# EAGLE board BAIT MicroMod Carrier Board (EAGLE 9.6.2)
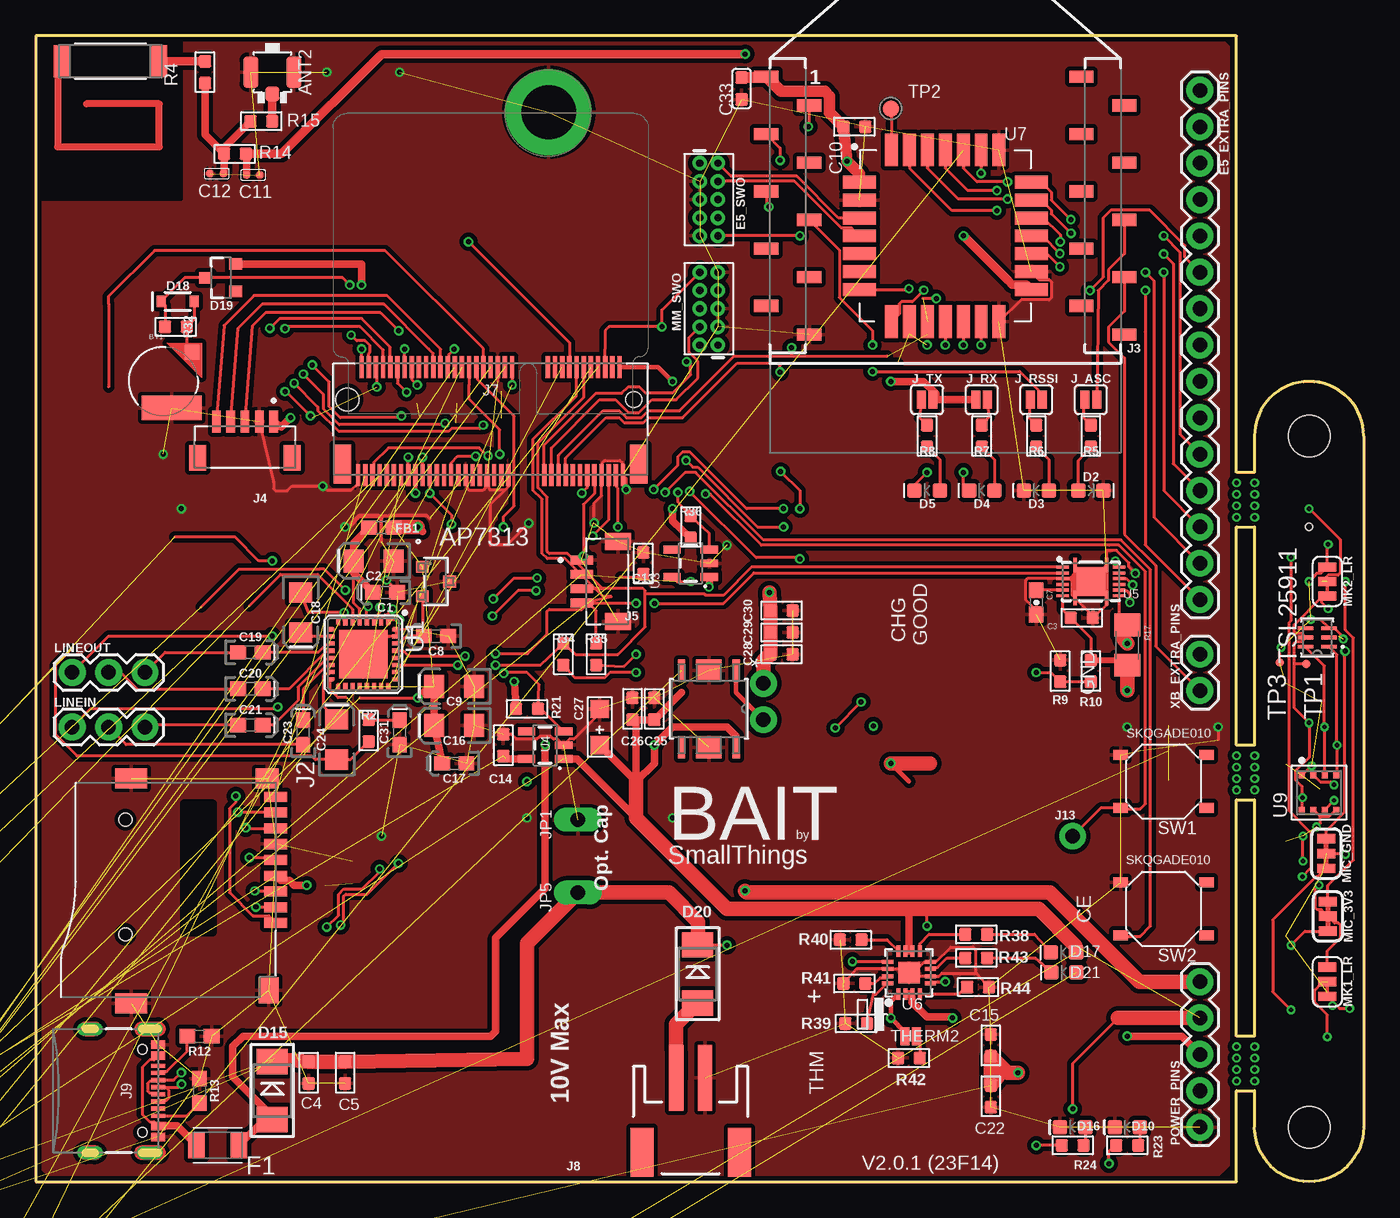
[diagram p2: board, top side]
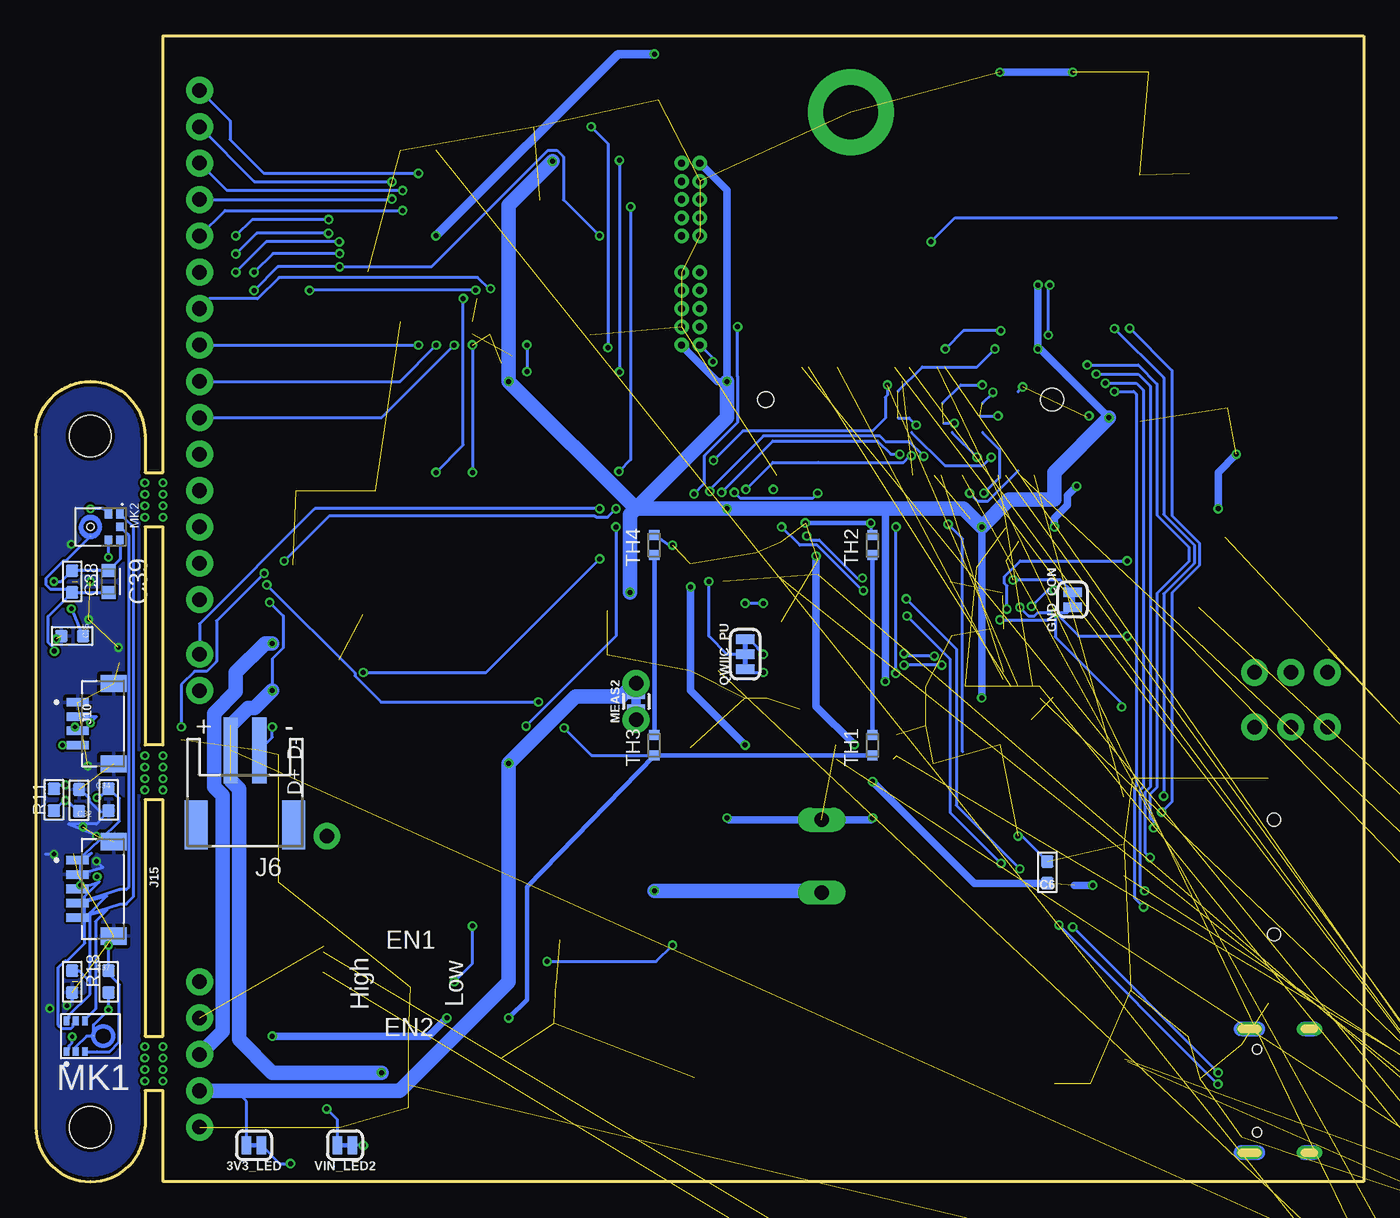
[diagram p3: board, bottom side, seen from below]

Size 92.71 x 80.01 mm. Coordinates in mm from the lower left corner, seen from the top.
Outline: 92.71,52.07 arc90 88.9,55.88
Outline: 92.71,52.07 92.71,3.81 arc-180 85.09,3.81 85.09,6.35 83.82,6.35 83.82,0 0,0 0,80.01 83.82,80.01 83.82,49.53 85.09,49.53 85.09,52.07 arc-180 92.71,52.07
Outline: 83.82,30.48 85.09,30.48 85.09,45.72 83.82,45.72 83.82,30.48
Outline: 83.82,26.67 85.09,26.67 85.09,10.16 83.82,10.16 83.82,26.67
Copper layers (1*16): Top 0.035mm / dielectric 1.5mm / Bottom 0.035mm
Design rules "seeed-studio-2-layer": minimum track width 6mil, minimum drill 12mil, track to track 6mil, track to pad 6mil, pad to pad 6mil, via to via 6mil, smd to smd 0mil, copper to edge 10mil, drill to drill 10mil, minimum pad ring 10mil, minimum via ring 6mil, stop-mask expansion 2mil, vias tented up to drill 100mil, thermal gap 10mil
Net classes: 0 default: width 0 mm, drill 0 mm
Holes 2.9 mm at 88.9,3.81 88.9,52.07
tKeepout: area 0,69 to 10,80
bKeepout: area 0,69 to 10,72

## Footprints (pad centres in the part's own frame; a part is rotated, then mirrored left to right if it is on the bottom)
SMT-JUMPER_2_NC_TRACE_SILK = smd 0.66 x 1.27: 1 -0.521,0; 2 0.521,0
SMT-JUMPER_3_1-NC_TRACE_SILK = smd 0.635 x 1.27: 1 -1.016,0; 2 0,0; 3 1.016,0
ANT_0868AT43A0020E_JOT = smd 1.168 x 2.21: 1 -3.378,0; 2 3.378,0
U-FL3P-SMD-2.6X2.6X1.0MM = smd 1.05 x 1: D -1.524,0 | smd 2.2 x 1.05: GND1 0,1.5; GND2 0,-1.5
SMT-JUMPER_2_NO_NO-SILK = smd 0.635 x 1.27: 1 -0.406,0; 2 0.406,0
ML414H_IV01E = smd 1 x 1: + 2.022,2.032 | smd 4.2 x 1.7: - 0.6,-1.85
0603-POLAR = smd 1.1 x 1: + 0.85,0; - -0.85,0
EIA3216 = smd 1.4 x 1.6: + 1.4,0; - -1.4,0
C0603 = smd 0.889 x 0.889: 1 0,0.762; 2 0,-0.762
0603-CAP = smd 1.1 x 1: 1 -0.85,0; 2 0.85,0
C0402 = smd 0.5 x 0.5: 1 -0.463,0; 2 0.463,0
AVX-A = smd 1.27 x 1.27: + -1.27,0; - 1.27,0
C0603' = smd 0.889 x 0.889: 1 -0.762,0; 2 0.762,0
CAPC1608X85 = smd 0.921 x 0.97: 1 -0.775,0; 2 0.775,0
LED-0603 = smd 1 x 1: A -0.877,0; C 0.877,0
SMADIODE = smd 1.778 x 2.159: A 2.019,0; C -2.045,0
SOD-323 = smd 0.63 x 0.83: A 1.15,0; C -1.15,0
SOT23-3 = smd 0.8 x 0.9: 1 -0.95,-1; 2 0.95,-1; 3 0,1.1
1X15 = drill 1.016 pad 1.88: 1 0,0; 2 2.54,0; 3 5.08,0; 4 7.62,0; 5 10.16,0; 6 12.7,0; 7 15.24,0; 8 17.78,0; 9 20.32,0; 10 22.86,0; 11 25.4,0; 12 27.94,0; 13 30.48,0; 14 33.02,0; 15 35.56,0
2X5-PTH-1.27MM = drill 0.508 pad 1: 1 -2.54,-0.635; 2 -2.54,0.635; 3 -1.27,-0.635; 4 -1.27,0.635; 5 0,-0.635; 6 0,0.635; 7 1.27,-0.635; 8 1.27,0.635; 9 2.54,-0.635; 10 2.54,0.635
FUSC3215X82N = smd 1.165 x 1.814: 1 -1.475,0; 2 1.475,0
0603 = smd 1.1 x 1: 1 -0.85,0; 2 0.85,0
STAND-OFF-REFLOW-M2.5 = drill 3.8 pad 6: 1 0,0
SUNTECH_ST-TF-003A = smd 0.7 x 1.6: 1 3.52,5.33; 2 2.42,5.33; 3 1.32,5.33; 4 0.22,5.33; 5 -0.88,5.33; 6 -1.98,5.33; 7 -3.08,5.33; 8 -4.18,5.33; 9 -5.28,5.33 | smd 1.4 x 1.6: G1 -6.58,4.73 | smd 1.4 x 2.2: G2 -6.58,-4.77; G3 9.12,-4.77 | smd 1.8 x 1.4: G4 8.22,4.83 | hole 0.9: -3.68,-5.17; 4.32,-5.17
XBEE-SMD = smd 1.7 x 0.85: 1 -12.5,20; 2 -9.5,18; 3 -12.5,16; 4 -9.5,14; 5 -12.5,12; 6 -9.5,10; 7 -12.5,8; 8 -9.5,6; 9 -12.5,4; 10 -9.5,2; 11 12.5,2; 12 9.5,4; 13 12.5,6; 14 9.5,8; 15 12.5,10; 16 9.5,12; 17 12.5,14; 18 9.5,16; 19 12.5,18; 20 9.5,20
JST_BM05B-SRSS-TB(LF)(SN) = smd 0.6 x 1.55: 1 -2,-2.525; 2 -1,-2.525; 3 0,-2.525; 4 1,-2.525; 5 2,-2.525 | smd 1.2 x 1.8: S1 -3.3,0; S2 3.3,0
JST_BM04B-SRSS-TB(LF)(SN) = smd 0.6 x 1.55: 1 -1.5,-2.525; 2 -0.5,-2.525; 3 0.5,-2.525; 4 1.5,-2.525 | smd 1.2 x 1.8: S1 -2.8,0; S2 2.8,0
JST-PH-2-SMT-RA = smd 1 x 4.6: 1 1,-3.7; 2 -1,-3.7 | smd 1.6 x 3.4: NC1 -3.4,1.5; NC2 3.4,1.5
M.2-CONNECTOR-E = smd 0.3 x 1.55: 1 9.25,-5.275; 2 9,2.275; 3 8.75,-5.275; 4 8.5,2.275; 5 8.25,-5.275; 6 8,2.275; 7 7.75,-5.275; 8 7.5,2.275; 9 7.25,-5.275; 10 7,2.275; 11 6.75,-5.275; 12 6.5,2.275; 13 6.25,-5.275; 14 6,2.275; 15 5.75,-5.275; 16 5.5,2.275; 17 5.25,-5.275; 18 5,2.275; 19 4.75,-5.275; 20 4.5,2.275; 21 4.25,-5.275; 22 4,2.275; 23 3.75,-5.275; 32 1.5,2.275; 33 1.25,-5.275; 34 1,2.275; 35 0.75,-5.275; 36 0.5,2.275; 37 0.25,-5.275; 38 0,2.275; 39 -0.25,-5.275; 40 -0.5,2.275; 41 -0.75,-5.275; 42 -1,2.275; 43 -1.25,-5.275; 44 -1.5,2.275; 45 -1.75,-5.275; 46 -2,2.275; 47 -2.25,-5.275; 48 -2.5,2.275; 49 -2.75,-5.275; 50 -3,2.275; 51 -3.25,-5.275; 52 -3.5,2.275; 53 -3.75,-5.275; 54 -4,2.275; 55 -4.25,-5.275; 56 -4.5,2.275; 57 -4.75,-5.275; 58 -5,2.275; 59 -5.25,-5.275; 60 -5.5,2.275; 61 -5.75,-5.275; 62 -6,2.275; 63 -6.25,-5.275; 64 -6.5,2.275; 65 -6.75,-5.275; 66 -7,2.275; 67 -7.25,-5.275; 68 -7.5,2.275; 69 -7.75,-5.275; 70 -8,2.275; 71 -8.25,-5.275; 72 -8.5,2.275; 73 -8.75,-5.275; 74 -9,2.275; 75 -9.25,-5.275 | smd 1.2 x 2.75: A1 10.35,-4.5; A2 -10.35,-4.5 | hole 1.1: 10,0 | hole 1.6: -10,0
JST-2-SMD = smd 1 x 4.6: 1 -1,-3.7; 2 1,-3.7 | smd 1.6 x 3.4: NC1 -3.4,1.5; NC2 3.4,1.5
USB-C-16P-2LAYER-PADS = smd 0.3 x 1: A5 -1.25,-0.34; A6 -0.25,-0.34; A7 0.25,-0.34; A8 1.25,-0.34; B5 1.75,-0.34; B6 0.75,-0.34; B7 -0.75,-0.34; B8 -1.75,-0.34 | smd 0.6 x 1: GND -3.225,-0.34; GND2 3.225,-0.34; VBUS1 -2.45,-0.34; VBUS2 2.45,-0.34 | drill 0.4 pad 0.6 long: SHLD1 -4.318,-0.915; SHLD2 4.318,-0.915; SHLD3 -4.318,-5.095; SHLD4 4.318,-5.095 | hole 0.65: -2.89,-1.445; 2.89,-1.445
CONN8_MS02QE_CNK = drill 1.651 pad 2.159: 1 0,0; 2 0,-4.6; 3 0,-9.2; 4 0,-13.8; 5 5.72,-13.8; 6 5.72,-9.2; 7 5.72,-4.6; 8 5.72,0
1X01_NO_SILK = drill 1.016 pad 1.88: 1 0,0
CUI_SJ-3551B-MSMT-TR-67 = drill 0.4 pad 0.8 long: 1 4.7,-1.54; 2 4.7,-9.42; 3 4.7,-4.63; 4 -4.7,-1.62; 5 -4.7,-5.57; 6 -4.7,-8.37
SMT-JUMPER_2_NO_SILK = smd 0.635 x 1.27: 1 -0.406,0; 2 0.406,0
1X01_OVAL = drill 1 pad 1.676 long: 1 0,0
SMT-JUMPER_2_NC_TRACE_NO-SILK = smd 0.66 x 1.27: 1 -0.521,0; 2 0.521,0
1X03 = drill 1.016 pad 1.88: 1 0,0; 2 2.54,0; 3 5.08,0
COMBO-JUMPER_2_NC_TRACE = smd 0.635 x 1.27: 1 -0.508,0; 2 0.508,0 | drill 1.016 pad 1.88: 3 -1.27,0; 4 1.27,0
SMT-JUMPER_3_2-NC_TRACE_SILK = smd 0.66 x 1.27: 1 -1.041,0; 2 0,0; 3 1.041,0
ICS-43432 = smd 0.6 x 0.4: 1 -1.075,1.675; 2 -1.075,1.025; 3 -1.075,0.375; 5 1.075,0.375; 6 1.075,1.025; 7 1.075,1.675 | smd 0.1 x 0.1: 4 0.025,-0.225
MIC_SPH0645LM4H-B = smd 0.6 x 0.522: 1 -0.9,2.074; 2 -0.9,1.252; 4 0.9,1.252; 5 0.9,2.074; 6 0,2.074 | smd 0.1 x 0.1: 3 0.65,0.02 | hole 0.5: 0,0
1X05 = drill 1.016 pad 1.88: 1 0,0; 2 2.54,0; 3 5.08,0; 4 7.62,0; 5 10.16,0
R0603 = smd 0.889 x 0.889: 1 0,0.762; 2 0,-0.762
1206 = smd 1.6 x 1.8: 1 -1.4,0; 2 1.4,0
AXIAL-0.3 = drill 0.9 pad 1.88: P$1 -3.81,0; P$2 3.81,0
SW4-SMD-5.2X5.2X1.5MM = smd 1 x 0.7: 1 -3,1.85; 2 3,1.85; 3 -3,-1.85; 4 3,-1.85
THERM_NTCG163JX103DT1S = smd 0.7 x 0.7: 1 -0.7,0; 2 0.7,0
TP06R = smd 0.6 x 0.6: TP 0,0
TP-D45MIL = smd 1.143 x 1.143: T 0,0
QFN-32-5MM = smd 0.4 x 0.29: 1 -2.3,1.75; 8 -2.3,-1.75; 17 2.3,-1.75; 24 2.3,1.75 | smd 0.5 x 0.29: 2 -2.25,1.25; 3 -2.25,0.75; 4 -2.25,0.25; 5 -2.25,-0.25; 6 -2.25,-0.75; 7 -2.25,-1.25; 18 2.25,-1.25; 19 2.25,-0.75; 20 2.25,-0.25; 21 2.25,0.25; 22 2.25,0.75; 23 2.25,1.25 | smd 0.29 x 0.4: 9 -1.75,-2.3; 16 1.75,-2.3; 25 1.75,2.3; 32 -1.75,2.3 | smd 0.29 x 0.5: 10 -1.25,-2.25; 11 -0.75,-2.25; 12 -0.25,-2.25; 13 0.25,-2.25; 14 0.75,-2.25; 15 1.25,-2.25; 26 1.25,2.25; 27 0.75,2.25; 28 0.25,2.25; 29 -0.25,2.25; 30 -0.75,2.25; 31 -1.25,2.25 | smd 3.4 x 3.4: PAD 0,0
SOT-23_DIO = smd 0.813 x 0.889: 1 -1.025,-0.945; 2 1.025,-0.945; 3 0,0.945
SOT23-5 = smd 0.55 x 1.2: 1 -0.95,-1.3; 2 0,-1.3; 3 0.95,-1.3; 4 0.95,1.3; 5 -0.95,1.3
PDSO-N12 = smd 0.2 x 0.85: 1 -1,-1.975; 2 -0.6,-1.975; 3 -0.2,-1.975; 4 0.2,-1.975; 5 0.6,-1.975; 6 1,-1.975; 7 1,1.975; 8 0.6,1.975; 9 0.2,1.975; 10 -0.2,1.975; 11 -0.6,1.975; 12 -1,1.975 | smd 1.95 x 1.95: EP 0,0 | smd 1 x 0.25: EP1 -1.15,1.1; EP2 -1.15,-1.1; EP3 1.15,-1.1; EP4 1.15,1.1
QFN16_3MM = smd 0.8 x 0.28: 1 -1.5,0.75; 2 -1.5,0.25; 3 -1.5,-0.25; 4 -1.5,-0.75; 9 1.5,-0.75; 10 1.5,-0.25; 11 1.5,0.25; 12 1.5,0.75 | smd 0.28 x 0.8: 5 -0.75,-1.5; 6 -0.25,-1.5; 7 0.25,-1.5; 8 0.75,-1.5; 13 0.75,1.5; 14 0.25,1.5; 15 -0.25,1.5; 16 -0.75,1.5 | smd 1.5 x 1.5: THERMAL 0,0
MOUDLE28P-1.25-12X12X2.5MM = smd 2.3 x 0.9: 1 -6,3.75; 2 -6,2.5; 3 -6,1.25; 4 -6,0; 5 -6,-1.25; 6 -6,-2.5; 7 -6,-3.75; 15 6,-3.75; 16 6,-2.5; 17 6,-1.25; 18 6,0; 19 6,1.25; 20 6,2.5; 21 6,3.75 | smd 0.9 x 2.3: 8 -3.75,-6; 9 -2.5,-6; 10 -1.25,-6; 11 0,-6; 12 1.25,-6; 13 2.5,-6; 14 3.75,-6; 22 3.75,6; 23 2.5,6; 24 1.25,6; 25 0,6; 26 -1.25,6; 27 -2.5,6; 28 -3.75,6
HSOP-6_FH006-A-P-SD-2.1_ABL = smd 1.513 x 0.517: 1 -2.692,1.91; 3 -2.692,-1.91; 4 2.692,-1.91; 6 2.692,1.91 | smd 1.513 x 1.787: 2 -2.692,0; 5 2.692,0
BOSCH_TOOLS_BME680_0 = smd 0.4 x 0.4: 1 1.2,1.2; 2 1.2,0.4; 3 1.2,-0.4; 4 1.2,-1.2; 5 -1.2,-1.2; 6 -1.2,-0.4; 7 -1.2,0.4; 8 -1.2,1.2
SON-06-FN_2000X2400_AMS = smd 1.067 x 0.254: 1 -0.826,0.65; 2 -0.826,0; 3 -0.826,-0.65; 4 0.826,-0.65; 5 0.826,0; 6 0.826,0.65
MSOP-12_MS_LIT = smd 1.328 x 0.431: 1 -2.213,1.626; 2 -2.213,0.975; 3 -2.213,0.325; 4 -2.213,-0.325; 5 -2.213,-0.975; 6 -2.213,-1.626; 7 2.213,-1.626; 8 2.213,-0.975; 9 2.213,-0.325; 10 2.213,0.325; 11 2.213,0.975; 12 2.213,1.626
1X02 = drill 1.016 pad 1.88: 1 0,0; 2 2.54,0

## Placement (x,y rotation side)
3V3_LED  [SMT-JUMPER_2_NC_TRACE_SILK]  77.47,2.54 180 bottom
3V_CODEC_JP  MK2_LR  [SMT-JUMPER_3_1-NC_TRACE_SILK]  -13.68,-8.62 0 top  (outside the outline)
3V_QWIIC2_JP  MK2_LR  [SMT-JUMPER_3_1-NC_TRACE_SILK]  -13.68,-36.96 0 top  (outside the outline)
3V_QWIIC_JP  MK2_LR  [SMT-JUMPER_3_1-NC_TRACE_SILK]  -9.99,1.75 0 top  (outside the outline)
3V_SD_JP  MK2_LR  [SMT-JUMPER_3_1-NC_TRACE_SILK]  -14.58,1.75 0 top  (outside the outline)
ANT1  0868AT43A0020EANT_0868AT43A0020E_JOT  [ANT_0868AT43A0020E_JOT]  5.21,78.23 180 top
ANT2  U-FL Connector  [U-FL3P-SMD-2.6X2.6X1.0MM]  16.51,77.47 90 top
AT_MODE  MK2_LR  [SMT-JUMPER_3_1-NC_TRACE_SILK]  -25.88,-40.83 0 top  (outside the outline)
BATT_PWR  [SMT-JUMPER_2_NO_NO-SILK]  -62.49,-40.83 0 top  (outside the outline)
BT1  ML414H  [ML414H_IV01E]  8.89,55.88 0 top
C1  2.2uF  [0603-POLAR]  24.38,41.15 180 top
C2  0.1uF  [EIA3216]  23.58,43.35 180 top
C3  1uf  [C0603]  73.03,39.37 90 top
C4  4.7uf  [C0603]  19.05,7.62 0 top
C5  4.7uf  [C0603]  21.59,7.62 0 top
C6  100nf  [C0603]  22.09,21.6 180 bottom
C7  0.47uF  [0603-CAP]  69.85,40.45 270 top
C8  2.2uF  [0603-POLAR]  27.94,38.1 180 top
C9  0.1uF  [EIA3216]  29.21,34.59 180 top
C10  4.7uf  [C0603]  57.15,73.66 270 top
C11  DNP  [C0402]  15.17,70.29 180 top
C12  DNP  [C0402]  12.63,70.39 0 top
C13  1uf  [C0603]  42.42,43.18 180 top
C14  1uf  [C0603]  32.64,30.48 180 top
C15  4.7uf  [C0603]  66.67,9.53 180 top
C16  0.1uF  [EIA3216]  29.21,31.85 180 top
C17  2.2uF  [0603-POLAR]  29.21,29.21 180 top
C18  0.15uF  [EIA3216]  18.5,39.74 270 top
C19  2.2uF  [0603-POLAR]  14.99,36.96 0 top
C20  2.2uF  [0603-POLAR]  14.99,34.42 0 top
C21  2.2uF  [0603-POLAR]  14.99,31.88 0 top
C22  4.7uf  [C0603]  66.67,5.97 0 top
C23  2.2uF  [0603-POLAR]  18.67,31.37 90 top
C24  0.1uF  [EIA3216]  21.01,30.87 90 top
C25  220nf  [C0603]  43.18,33.02 180 top
C26  100nf  [C0603]  41.66,33.02 180 top
C27  10uf  [AVX-A]  39.37,31.75 90 top
C28  1uf  [C0603]  52.07,36.83 90 top
C29  100nf  [C0603]  52.07,38.35 90 top
C30  220nf  [C0603]  52.07,39.88 90 top
C31  2.2uF  [0603-POLAR]  25.4,31.37 90 top
C32  100nf  [C0603]  89.69,26.63 180 bottom
C33  4.7uF  [C0603']  49.28,76.33 90 top
C34  100nf  [C0603]  87.63,26.67 0 bottom
C35  100nf  [C0603]  90.17,38.1 270 bottom
C36  1uf  [C0603]  -10.39,-12.35 0 top  (outside the outline)
C37  100nf  [C0603]  87.63,13.97 0 bottom
C38  100nf  [C0603]  90.17,41.91 0 bottom
C39  220pF  [CAPC1608X85]  87.63,41.91 270 bottom
C40  1uf  [C0603]  -10.39,-40.69 0 top  (outside the outline)
C41  100nf  [C0603]  -75.41,-83.47 0 top  (outside the outline)
CHG_JMP  [SMT-JUMPER_2_NO_NO-SILK]  -22.08,-40.83 0 top  (outside the outline)
D2  GREEN  [LED-0603]  73.66,48.26 0 top
D3  GREEN  [LED-0603]  69.85,48.26 180 top
D4  GREEN  [LED-0603]  66.04,48.26 180 top
D5  RED  [LED-0603]  62.23,48.26 180 top
D10  RED  [LED-0603]  76.2,3.81 180 top
D15  SK34A  [SMADIODE]  16.51,6.35 270 top
D16  Yellow  [LED-0603]  72.39,3.81 180 top
D17  RED  [LED-0603]  71.75,16 180 top
D18  3A/10V/280mV  [SOD-323]  9.91,61.47 0 top
D19  BAS70-05  [SOT23-3]  12.95,63.12 90 top
D20  SK34A  [SMADIODE]  46.21,14.49 270 top
D21  GREEN  [LED-0603]  71.78,14.61 180 top
E5_EXTRA_PINS  [1X15]  81.28,76.2 270 top
E5_SWO  JTAG  [2X5-PTH-1.27MM]  46.99,68.58 270 top
F1  6V/2A  [FUSC3215X82N]  12.7,2.54 0 top
FB1  600Ω/1.8A  [0603]  24.11,45.68 180 top
GND_CON  [SMT-JUMPER_2_NC_TRACE_SILK]  20.32,40.64 90 bottom
H5  STAND-OFF-REFLOW2.5MM_TALL  [STAND-OFF-REFLOW-M2.5]  35.81,74.68 0 top
J2  ST-TF-003A  [SUNTECH_ST-TF-003A]  11.43,21.59 270 top
J3  [XBEE-SMD]  63.5,57.15 0 top
J4  BM05B-SRSS-TB(LF)(SN)  [JST_BM05B-SRSS-TB(LF)(SN)]  14.61,50.55 180 top
J5  QWIIC_RIGHT_ANGLE  [JST_BM04B-SRSS-TB(LF)(SN)]  40.64,41.91 270 top
J6  JST 2PH  [JST-PH-2-SMT-RA]  78.11,26.42 180 bottom
J7  MICROMOD-2222-C  [M.2-CONNECTOR-E]  31.75,54.61 0 top
J8  [JST-2-SMD]  45.72,3.56 180 top
J9  [USB-C-16P-2LAYER-PADS]  8.89,6.35 270 top
J10  QWIIC_RIGHT_ANGLE  [JST_BM04B-SRSS-TB(LF)(SN)]  87.27,31.98 270 bottom
J11  QWIIC_RIGHT_ANGLE  [JST_BM04B-SRSS-TB(LF)(SN)]  -12.56,-18.43 0 top  (outside the outline)
J12  L203011MS02QECONN8_MS02QE_CNK  [CONN8_MS02QE_CNK]  -44.42,-13.78 0 top  (outside the outline)
J13  [1X01_NO_SILK]  72.39,24.13 0 top
J14  SJ-3551B-MSMT-TR-67  [CUI_SJ-3551B-MSMT-TR-67]  -123.91,-88.23 0 top  (outside the outline)
J15  BM05B-SRSS-TB(LF)(SN)  [JST_BM05B-SRSS-TB(LF)(SN)]  87.28,20.45 270 bottom
J_ASC  JUMPER-SMT_2_NO_SILK  [SMT-JUMPER_2_NO_SILK]  73.66,54.61 0 top
J_RSSI  JUMPER-SMT_2_NO_SILK  [SMT-JUMPER_2_NO_SILK]  69.85,54.61 0 top
J_RX  JUMPER-SMT_2_NO_SILK  [SMT-JUMPER_2_NO_SILK]  66.04,54.61 0 top
J_TX  JUMPER-SMT_2_NO_SILK  [SMT-JUMPER_2_NO_SILK]  62.23,54.61 0 top
JP1  [1X01_OVAL]  37.85,25.27 90 top
JP2  JUMPER-SMT_2_NC_TRACE_NO-SILK  [SMT-JUMPER_2_NC_TRACE_NO-SILK]  -87.75,-102.97 0 top  (outside the outline)
JP3  JUMPER-SMT_2_NC_TRACE_NO-SILK  [SMT-JUMPER_2_NC_TRACE_NO-SILK]  -97.19,-102.97 0 top  (outside the outline)
JP4  JUMPER-SMT_2_NC_TRACE_NO-SILK  [SMT-JUMPER_2_NC_TRACE_NO-SILK]  -106.62,-102.97 0 top  (outside the outline)
JP5  [1X01_OVAL]  37.85,20.19 90 top
LINEIN  [1X03]  2.54,31.75 0 top
LINEOUT  [1X03]  2.54,35.56 0 top
MEAS2  [COMBO-JUMPER_2_NC_TRACE]  50.8,33.53 90 bottom
MIC_3V3  [SMT-JUMPER_3_2-NC_TRACE_SILK]  90.21,18.53 270 top
MIC_GND  [SMT-JUMPER_3_2-NC_TRACE_SILK]  90.09,22.92 270 top
MK1  ICS-43432  [ICS-43432]  88.9,10.16 90 bottom
MK1_LR  MK1_LR  [SMT-JUMPER_3_1-NC_TRACE_SILK]  90.17,13.97 270 top
MK2  SPH0645LM4H-B  [MIC_SPH0645LM4H-B]  88.9,45.72 270 bottom
MK2_LR  MK2_LR  [SMT-JUMPER_3_1-NC_TRACE_SILK]  90.17,41.91 270 top
MM_SWO  JTAG  [2X5-PTH-1.27MM]  46.99,60.96 90 top
PGOOD_JMP  [SMT-JUMPER_2_NO_NO-SILK]  -18.51,-40.83 0 top  (outside the outline)
POWER_PINS  [1X05]  81.28,3.81 90 top
QWIIC2_PU  [SMT-JUMPER_3_2-NC_TRACE_SILK]  -5.9,-26.72 0 top  (outside the outline)
QWIIC_PU  [SMT-JUMPER_3_2-NC_TRACE_SILK]  43.18,36.83 90 bottom
R1  100K  [R0603]  -14.43,-12.03 0 top  (outside the outline)
R2  2.2K  [R0603]  23.24,31.5 0 top
R3  2.2K  [R0603]  -14.43,-26.13 0 top  (outside the outline)
R4  0R  [R0603]  11.81,77.47 180 top
R5  4.7K  [R0603]  73.66,52.07 180 top
R6  1K 1/10W  [R0603]  69.85,52.07 180 top
R7  1K 1/10W  [R0603]  66.04,52.07 180 top
R8  1K 1/10W  [R0603]  62.23,52.07 180 top
R9  10K 1/10W  [R0603]  71.52,35.66 0 top
R10  20K  [R0603]  73.66,35.66 180 top
R11  4.7K  [R0603]  91.44,26.67 0 bottom
R12  5.1k  [0603]  11.43,10.16 180 top
R13  5.1k  [0603]  11.43,6.35 270 top
R14  0R  [R0603]  13.9,71.77 270 top
R15  0R  [R0603]  15.75,74.04 90 top
R16  2.2K  [R0603]  -10.19,-26.13 0 top  (outside the outline)
R17  0.01  [1206]  76.2,37.47 270 top
R18  100K  [R0603]  90.17,13.97 180 bottom
R19  100K  [R0603]  -14.43,-40.37 0 top  (outside the outline)
R20  100K  [R0603]  -66.7,-84.52 0 top  (outside the outline)
R21  100K  [R0603]  34.29,33.02 270 top
R22  1.02M  [R0603]  -70.94,-84.52 0 top  (outside the outline)
R23  1K 1/10W  [R0603]  76.2,2.54 270 top
R24  4.7K  [R0603]  72.39,2.54 270 top
R25  61.9k  [R0603]  -79.44,-84.52 0 top  (outside the outline)
R26  115k  [R0603]  -83.68,-84.52 0 top  (outside the outline)
R27  [AXIAL-0.3]  -81.18,-95.6 0 top  (outside the outline)
R28  [AXIAL-0.3]  -81.18,-99.35 0 top  (outside the outline)
R29  [AXIAL-0.3]  -81.18,-103.1 0 top  (outside the outline)
R32  3.3K  [R0603]  9.78,59.69 270 top
R34  2.2K  [R0603]  36.83,36.83 0 top
R35  2.2K  [R0603]  39.12,36.83 0 top
R36  100K  [R0603]  45.72,45.72 0 top
R38  10K 1/10W  [R0603]  65.66,17.27 90 top
R39  590  [R0603]  57.28,11.05 270 top
R40  1K 1/10W  [R0603]  56.9,16.89 270 top
R41  10K 1/10W  [R0603]  57.15,13.84 270 top
R42  10K 1/10W  [R0603]  60.96,8.64 270 top
R43  10K 1/10W  [R0603]  65.66,15.62 90 top
R44  10K 1/10W  [R0603]  65.79,13.59 90 top
SW1  SKQGADE010  [SW4-SMD-5.2X5.2X1.5MM]  78.74,27.94 180 top
SW2  SKQGADE010  [SW4-SMD-5.2X5.2X1.5MM]  78.74,19.05 180 top
SW3  SKQGADE010  [SW4-SMD-5.2X5.2X1.5MM]  -82.43,-91.01 0 top  (outside the outline)
TH1  10k  [THERM_NTCG163JX103DT1S]  34.29,30.48 90 bottom
TH2  10k  [THERM_NTCG163JX103DT1S]  34.29,44.45 90 bottom
TH3  10k  [THERM_NTCG163JX103DT1S]  49.53,30.48 90 bottom
TH4  10k  [THERM_NTCG163JX103DT1S]  49.53,44.45 90 bottom
THERM2  [SMT-JUMPER_2_NO_NO-SILK]  61.09,10.16 180 top
TP1  PTR1TP06R  [TP06R]  88.7,36.16 0 top
TP2  TEST  [TP-D45MIL]  59.69,74.93 0 top
TP3  PTR1TP06R  [TP06R]  86.86,36.26 0 top
U1  SGTL5000-32  [QFN-32-5MM]  22.86,36.83 270 top
U2  AP7313  [SOT-23_DIO]  27.94,41.91 270 top
U3  3.3V  [SOT23-5]  45.72,43.18 90 top
U4  3.3V  [SOT23-5]  35.56,30.48 90 top
U5  BQ27441-G1  [PDSO-N12]  73.66,41.91 270 top
U6  BQ24074  [QFN16_3MM]  60.96,14.61 90 top
U7  LoRa-E5-HF  [MOUDLE28P-1.25-12X12X2.5MM]  63.5,66.04 0 top
U8  S-1172B33-E6T1U  [HSOP-6_FH006-A-P-SD-2.1_ABL]  46.99,33.02 270 top
U9  BOSCH_TOOLS_BME680BOSCH_TOOLS_BME680_0_0  [BOSCH_TOOLS_BME680_0]  89.59,27.17 90 top
U10  TSL25911  [SON-06-FN_2000X2400_AMS]  89.47,38 180 top
U11  3.3V  [SOT23-5]  -14.44,-3.27 0 top  (outside the outline)
U12  3.3V  [SOT23-5]  -14.44,-31.61 0 top  (outside the outline)
U13  LTC2956IMS-1PBF  [MSOP-12_MS_LIT]  -49.44,-50.1 0 top  (outside the outline)
USB_PWR  [SMT-JUMPER_2_NO_NO-SILK]  -58.66,-40.83 0 top  (outside the outline)
VIN_LED2  [SMT-JUMPER_2_NC_TRACE_SILK]  71.12,2.54 180 bottom
XB_EXTRA_PINS  [1X02]  81.28,34.29 90 top

## Tracks (layer width: path | path; a pad name or v marks a point on that pad's centre or on a via)
1.8V
  Top 0.203: U5.5 69.86,41.31 C7.1
3.3V  (via drill 0.35)  (7 unrouted)
  Top 0.203: J7.74 v22.75,58.14 | 22.61,33.78 v26.67,33.78
  Top 0.305: J7.2 43.45,56.88 v44.45,55.88 | v59.69,29.21 60.96,27.94
  Top 0.508: v26.67,45.72 27,45.4 | R21.2 33.44,34.89 v33.4,34.92 | v22.73,62.61 22.73,64.07 D19.2 | R36.2 44.45,46.14 v44.45,46.99 | J_TX.2 62.83,54.61 | 62.83,54.61 J_RX.1 | J4.1 17.14,52.7 v17.78,53.34 | v59.69,55.88 61.98,55.88 62.83,55.03 62.83,54.61 | v26.67,33.78 27.48,34.59
  Top 0.813: U7.1 57.5,70.39 v56.64,71.25 C10.2 55.41,74.64 55.41,75.81 55.08,76.13 52.02,76.13 J3.1 C33.2
  Top 1.016: MEAS2.4 50.8,36.41 C28.1 C29.1 C30.1 v51.22,41.15 | v59.69,29.21 62.43,29.21 | 25.01,45.72 v26.67,45.72
  Bottom 0.203: 3V3_LED.2 77.99,5.6 78.74,6.35
  Bottom 0.305: 50.8,34.07 MEAS2.2
  Bottom 0.406: MEAS2.4 50.8,34.07
  Bottom 0.508: v26.67,45.72 v26.67,33.78 | MM_SWO.1 47.27,58.06 47.27,58.04 45.11,55.88 v44.45,55.88 44.45,69.24 45.98,70.76 46,70.76 E5_SWO.1 | v17.78,53.34 22.58,58.14 v22.75,58.14 22.75,62.59 v22.73,62.61 | v33.4,34.92 33.4,42.76 33.38,42.78 33.38,46.63 33.02,46.99
  Bottom 1.016: MEAS2.4 51.22,34.38 51.33,34.38 51.84,33.87 55.03,33.87 v59.69,29.21 59.69,13.97 67.31,6.35 78.74,6.35 POWER_PINS.2 | 50.8,46.99 v59.69,55.88 59.69,68.2 v56.64,71.25 | 50.8,46.99 44.45,53.34 v44.45,55.88 | 50.8,46.99 v44.45,46.99 33.02,46.99 27.94,46.99 v26.67,45.72 24.77,47.62 21.59,47.62 21.59,49.53 v17.78,53.34 | 50.8,46.99 51.22,46.57 v51.22,41.15
3V3_B  (via drill 0.3)
  Top 0.203: 88.39,26.77 88.39,27.61 87.94,28.07 87.94,28.68 88.9,29.64 v88.9,32.04 87.86,33.08 87.86,36.2 | 88.39,26.77 U9.8 | 87.86,36.2 87.86,37.58 88.01,37.73 88.38,37.73 U10.5 88.38,38.27 88.01,38.27 87.86,38.42 87.86,38.88 89.79,40.81 | 89.79,40.81 89.79,40.89 MK2_LR.3 90.09,40.81 89.79,40.81 | v89.59,20.71 89.32,20.44 89.32,19.14 89.47,18.99 89.75,18.99 MIC_3V3.2 90.67,18.07 90.95,18.07 91.1,17.92 91.1,17.05 90.17,16.12 MK1_LR.1 | v90.23,40 89.79,40.44 89.79,40.81 | v88.43,26.81 88.39,26.77 | TP1.TP 87.9,36.16 87.86,36.2
  Bottom 0.203: J10.2 88.46,32.48 v88.9,32.04 | C35.1 90.17,39.94 v90.23,40 | v88.43,26.81 88.34,26.81 C34.1 86.88,26.77 86.88,25.16 87.28,24.77 J15.1 88.81,22.95 89.59,22.16 v89.59,20.71
3V3_ICS  (via drill 0.3)
  Top 0.203: v87.63,16.51 88.61,17.49 MIC_3V3.3
  Bottom 0.203: MK1.3 88.45,9.09 88.45,9.08 87.55,9.08 86.88,9.76 86.88,13.78 87.63,14.53 C37.1 v87.63,16.51
3V3_SPH  (via drill 0.3)
  Top 0.203: MIC_3V3.1 90.21,20.67 92,22.46 92,37.97 91.44,38.52 v91.44,41.91
  Bottom 0.203: MK2.5 86.83,43.49 C39.1 90.16,42.69 C38.1 90.93,41.91 v91.44,41.91
3V_CODEC  (4 unrouted)
  Top 0.508: C9.+ C16.+ 28.36,29.31 C17.+
3V_EN  (1 unrouted)
3V_QWIIC  (via drill 0.35)  (2 unrouted)
  Top 0.203: 44.74,41.91 v45.72,41.91
  Bottom 0.203: QWIIC_PU.2 44.45,36.83 45.72,38.1 v45.72,41.91
3V_QWIIC2  (2 unrouted)
3V_QWIIC_OUT  (1 unrouted)
  Top 0.203: C13.1 42.52,42.23 40.82,42.23
3V_QWIIC_OUT1  (2 unrouted)
3V_QWIIC_OUT2  (2 unrouted)
3V_SD  (via drill 0.35)  (2 unrouted)
  Top 0.508: v34.29,27.94 34.26,27.97 | J2.4 17.1,21.03 17.73,21.03 18.05,20.7 v18.92,20.7
  Bottom 0.508: v18.92,20.7 20.19,20.7 | 22.08,20.83 C6.1 27.19,20.84 v34.29,27.94
3V_SD_OUT  (2 unrouted)
  Top 0.508: 32.83,29.53 U4.5
!BOOT!  (via drill 0.35)
  Top 0.203: J7.11 38.5,48.46 v38.12,48.08 | v43.94,48.13 45.34,49.53 46.08,49.53 50.8,44.81 75.76,44.81 77.83,42.74 77.83,17.86 77.11,17.14 75.8,17.14 SW2.2
  Bottom 0.203: v43.94,48.13 43.56,47.75 38.45,47.75 v38.12,48.08
!CE
  Top 0.203: U6.4 64.45,13.11 R44.1
!CHG
  Top 0.203: U6.9 61.71,16.62 62.36,17.27 R38.1
!OFFALERT!  (1 unrouted)
!ONALERT!  (1 unrouted)
!PB  (1 unrouted)
!PBOUT!  (1 unrouted)
!PGOOD
  Top 0.203: U6.7 62.57,14.96 62.97,14.96 63.62,15.62 R43.1
!RESET!  (via drill 0.35)
  Top 0.203: J7.6 39.75,58.14 39.75,59.41 40.03,59.69 v43.72,59.69 43.72,60.86 MM_SWO.10 | v46.76,48.03 47.08,48.03 50.65,44.45 74.93,44.45 75.61,44.45 77.47,42.59 77.47,26.39 77.11,26.04 75.8,26.04 SW1.2 74.35,26.09 J13.1
  Bottom 0.203: v46.76,48.03 46.01,48.77 46.01,50.7 43.69,53.02 43.69,56.2 43.72,56.22 v43.72,59.69
!SLEEP!  (1 unrouted)
AGND  (via drill 0.35)  (1 unrouted)
  Top 0.152: 24.61,39.18 24.61,39.16
  Top 0.203: U1.7 21.53,39.16 v21.53,39.73 19.05,39.73 C18.- | LINEIN.1 3.81,33.02 16.76,33.02 v16.89,33.15 | LINEOUT.1 5.08,38.1 v16.51,38.1 | v25.4,39.23 24.71,39.23 24.66,39.18 24.61,39.18 | v24,40.1 24,39.73 23.71,39.44 23.71,39.18 U1.3
  Bottom 0.203: v21.53,39.73 19.89,38.1 v16.51,38.1 | v21.53,39.73 21.53,38.04 16.89,33.4 v16.89,33.15 | v21.53,39.73 20.7,39.73 GND_CON.1 | v21.53,39.73 22.75,39.73 22.98,39.51 23.41,39.51 v24,40.1 | v25.4,39.23 22.03,39.23 v21.53,39.73
ANT
  Top 0.5: 1.52,78.23 1.52,72.26 8.62,72.26 8.62,75.26 3.52,75.26
ASC
  Top 0.203: J3.15 76,64.78 74.9,63.68 74.9,62.95 74.18,62.23 J_ASC.2
CODEC_EN  (2 unrouted)
CUTOUT
  cutout Top: 0,80.01 10.16,80.01 10.16,68.58 0,68.58
GND  (via drill 0.35)  (94 unrouted)
  Top 0.152: U1.32 25.18,38.6 26,38.6
  Top 0.203: U6.THERMAL 61.31,14.61 62.02,15.32 62.42,15.32 U6.8 62.86,15.36 63.88,16.38 65.45,16.38 65.6,16.23 65.6,14.62 65.67,14.55 | U6.THERMAL 61.21,14.36 U6.6 63.06,14.36 63.26,14.55 65.67,14.55 | U6.THERMAL 60.71,14.86 U6.14 57.31,14.86 R41.2 | 65.67,14.55 R44.2 | U1.32 25.16,38.13 U1.31 24.11,38.08 U1.PAD | C7.2 69.85,39.89 69.1,40.64 69.1,41.95 69.25,42.1 71.68,42.1 U5.3 | U5.3 73.46,42.11 U5.EP 73.66,41.96 U5.EP1 74.76,44.09 75.44,44.09 76.31,43.22 76.31,42.93 v76.77,42.48 | U7.14 68.8,61.59 70.75,61.59 70.9,61.73 70.9,62.84 70.75,62.99 70.05,62.99 U7.16 | v82.55,31.75 82.55,30.86 | J7.45 30.1,49.24 30.1,48.45 30.25,48.31 31.25,48.31 31.4,48.45 31.4,49.24 J7.39 31.6,49.24 31.6,48.45 31.75,48.31 32.76,48.31 | J7.36 32.25,55.89 | J7.75 22.45,49.29 22.45,48.73 21.98,48.26 20.34,48.26 v20.04,48.56 17.86,48.56 17.55,48.25 16.74,48.25 16.59,48.4 16.59,48.83 J4.2 | v41.22,48.33 41.22,49.11 J7.1 40.95,49.38 40.95,50.17 40.76,50.36 39.74,50.36 39.55,50.17 39.55,49.38 J7.7 39.5,47.9 38.98,47.38 v38.98,46 | U5.3 71.73,42.15 72.21,42.15 72.56,42.5 U5.EP2 | U5.3 71.73,42.06 72.22,42.06 72.36,41.91 72.36,40.96 U5.EP3 73.88,39.45 C3.2 74.76,40.26 U5.EP4 | 25.23,40.91 C1.- 25.23,41.27 v24.49,42.01 | C27.- 39.37,32.71 37.56,30.9 37.28,30.9 U4.2 36.44,30.9 36.16,30.9 35.95,31.11 35.17,31.11 34.97,30.9 33.55,30.9 33.21,31.24 C14.2 | J7.33 33,48.55 32.76,48.31 | v34.42,45.97 33.02,44.58 33.02,44.45 31.75,44.45 31.75,47.3 32.76,48.31
  Top 0.254: 24.11,46.31 24.11,44.71 24.1,44.7 | 23.94,46.48 24.66,46.48 24.68,46.51 27.29,46.51 27.5,46.3
  Top 0.305: 24.11,46.31 23.94,46.48 22.59,46.48 21.82,45.72 v21.59,45.72
  Bottom 0.203: TH4.2 48.53,44.45 v48.26,44.45 | v34.42,45.97 34.42,45.28 TH2.2 | J6.2 76.2,31.02 v76.2,31.75 | v76.77,42.48 80.09,39.16 80.09,36.34 80.79,35.64 81.62,35.64 82.55,34.71 v82.55,31.75 | 22.26,22.61 C6.2 23.86,24.13 v24.13,24.13 | GND_CON.2 21.17,42.01 v24.49,42.01 | 38.95,45.97 v38.98,46
  Bottom 0.305: v34.42,45.97 34.45,46 v38.98,46
  Bottom 0.508: v34.29,25.4 34.42,25.27 JP1.1 44.32,25.27 v44.45,25.4 | v20.32,77.47 v25.4,77.47 | v20.04,48.56 20.68,47.92 20.68,47.25 21.59,46.33 v21.59,45.72 | v8.89,50.8 10.16,49.53 v10.16,46.99
  pour Top (isolate 0.305): 82.3,0.13 83.31,1.14 83.31,79.25 82.8,79.76 1.02,79.76 0.13,78.87 0.13,1.14 1.14,0.13
GND_B  (via drill 0.3)  (13 unrouted)
  Top 0.203: v88.47,22.39 v88.47,24.13 | v91.29,37.89 91.08,38.09 91.08,38.23 90.67,38.65 U10.3 89.69,39.25 v89.02,39.25 | v91.73,12.1 91.02,12.1 90.82,12.3 | MIC_GND.2 91.38,22.92 v91.44,22.86 | 89.69,25.52 90.3,25.52 90.75,25.97 U9.5 | U9.7 89.23,25.97 89.69,25.52 | v89.43,24.77 v89.42,24.77 89.69,25.04 89.69,25.52 | MK1_LR.3 90.82,12.3 | U9.1 89.05,29.03 v89.08,29.03 | v90.23,44.51 90.17,44.45 MK2_LR.1 89.72,42.48 89.43,42.48 89.28,42.33 89.28,42.29 v88.9,41.91 | v90.53,12.3 90.82,12.3 | TP3.TP 86.86,37.22 v86.94,37.3
  Bottom 0.203: J15.2 88.03,21.95 v88.47,22.39 | v91.44,22.86 92.02,22.86 | 90.17,12.7 R18.1 90.17,12.66 v90.53,12.3 | C32.2 88.99,26.78 88.99,26.58 88.23,25.82 C34.2 88.47,24.98 90.42,24.98 J15.S1
  pour Bottom: 85.09,52.07 85.09,3.66 arc180 92.61,3.65 92.61,52.1 arc180
GND_ICS  (via drill 0.3)
  Top 0.203: MIC_GND.3 89.48,21.27 89.36,21.27 86.36,18.27 86.36,13.27 v87.63,12
  Bottom 0.203: C37.2 v87.63,12 88.67,10.96 MK1.4 88.7,10.16 89.17,10.16 89.92,9.4 MK1.2
GND_SPH  (via drill 0.35)
  Top 0.203: MIC_GND.1 90.09,24.51 91.4,25.82 91.4,37.03 v91.42,37.05
  Bottom 0.203: C38.2 90.16,41.13 C39.2 | MK2.3 90.58,43.37 90.77,43.37 92,42.14 92,41.68 91.67,41.35 90.37,41.35 C38.2 | v91.42,37.05 91.42,37.23 91.84,37.66 91.84,39.47 C38.2
GPOUT  (via drill 0.35)
  Top 0.203: U5.12 75.37,43.17 v75.37,43.34 | v52.2,46.99 49.62,46.99 45.66,50.95 45.16,50.95 44.82,50.61 44.82,50.02 v43.13,48.33 | J7.71 23.6,49.43 23.6,50.22 24.62,51.23 30.96,51.23 31.5,50.7 v31.58,50.7
  Bottom 0.203: v75.37,43.34 72.21,46.5 53.67,46.5 53.58,46.41 52.78,46.41 v52.2,46.99 | v31.58,50.7 31.67,50.7 32.14,50.22 38.1,50.22 41.25,50.22 v43.13,48.33
HEADER_!CS!
  Top 0.203: 5.08,55.5 5.08,61.31 5.06,61.32 5.06,61.8 8.28,65.02 24.38,65.02 31.25,58.16 J7.40
HP_DETECT  (1 unrouted)
I2C1_SCL  (2 unrouted)
I2C2_SDA  (1 unrouted)
I2C_!INT!  (via drill 0.35)
  Top 0.203: v30.21,65.63 37.25,58.59 J7.16
  Bottom 0.203: v30.21,65.63 28.53,67.31 1.91,67.31
I2C_SCL  (via drill 0.35)
  Top 0.203: U5.2 50.13,42.51 48.01,40.39 v43.18,40.39 | J5.4 38.58,40.41 | 38.58,40.41 38.13,39.96 35.86,39.96 35.71,39.81 35.71,38.25 34.34,36.88 v32.09,36.88 | R35.1 39.12,39.87 38.58,40.41 | J5.4 41.89,40.41 v41.91,40.39 | J7.14 37.75,54.87 34.7,51.82 34.7,48.31 35.35,47.65 35.35,43.86 35.71,43.5 36.97,43.5 39.61,40.86 40.19,40.86 J5.4 | U1.29 25.66,37.08 26.04,36.7 v29.97,36.7
  Bottom 0.203: v41.91,40.39 v43.18,40.39 | v29.97,36.7 31.91,36.7 v32.09,36.88
I2C_SDA  (via drill 0.35)
  Top 0.203: J7.12 38.25,54.76 35.05,51.56 35.05,48.46 35.71,47.8 35.71,44.01 35.86,43.86 37.11,43.86 39.56,41.41 J5.3 42.41,41.41 42.55,41.27 42.55,41.02 | 42.55,41.02 42.55,38.73 40.64,36.83 37.68,36.83 R34.1 35.23,36.08 32.43,36.08 32.41,36.07 v32.09,36.07 | U5.1 49.96,42.91 48,40.95 46.75,40.95 46.68,41.02 42.55,41.02 | U1.27 29.44,36.08 v29.46,36.07
  Bottom 0.203: v29.46,36.07 v32.09,36.07
I2S2_MCLK  (1 unrouted)
I2S2_RX  (1 unrouted)
I2S2_SCK  (1 unrouted)
I2S2_TX  (1 unrouted)
I2S2_WS  (via drill 0.35)  (1 unrouted)
  Top 0.203: J7.32 v33.25,55.63 | v45.4,50.37 45.88,49.89 46.22,49.89 50.39,45.72 v52.21,45.72
  Bottom 0.203: v33.25,55.63 33.25,54.93 33.4,54.78 33.4,53.31 34.29,52.43 43.34,52.43 v45.4,50.37 | v52.21,45.72 52.21,38.09 v58.48,31.81
I2S_SCK  (via drill 0.35)
  Top 0.203: v25.34,59.41 24.07,60.68 16.04,60.68 15.14,59.78 J4.3 | J7.50 28.85,56.98 28.85,57.77 29.21,58.13 v29.21,58.14
  Bottom 0.203: v25.34,59.41 27.94,59.41 v29.21,58.14
I2S_SD
  Top 0.203: J7.54 27.75,57.82 27.43,58.14 24.31,61.26 15.8,61.26 14.14,59.61 J4.4
I2S_WS
  Top 0.203: J7.52 28.25,58.09 28.27,58.12 24.52,61.87 15.23,61.87 13.14,59.78 J4.5
ILIM
  Top 0.203: R40.1 59.42,16.89 U6.12
ISET
  Top 0.203: R39.1 58.47,13.09 58.64,13.09 59.41,13.86 U6.16
ITERM
  Top 0.203: U6.15 59.35,14.25 58.95,14.25 58.55,13.84 R41.1
N$1  (1 unrouted)
N$2  (1 unrouted)
N$3
  Top 0.203: R7.2 66.56,53.44 J_RX.2
N$4
  Top 0.203: J9.A5 8.65,7.7 9.15,7.7 10.58,9.12 R12.2
N$5
  Top 0.203: J9.B5 10.53,4.6 R13.2
N$6
  Top 0.305: U8.1 48.9,34.16 MEAS2.3
  Bottom 0.203: MEAS2.1 MEAS2.3
N$7
  Top 0.61: ANT2.D R15.2
N$8  (1 unrouted)
  Top 0.203: 14.91,40.22 17.09,42.4 19.69,42.4 22.11,39.98 U1.6
N$9
  Top 0.203: R7.1 66.92,50.43 D4.A
N$10
  Top 0.203: THERM2.1 61.72,9.93 R42.1
N$11
  Top 0.61: R4.2 ANT1.1
N$12  (via drill 0.3)
  other vias: 85.1,48.8
N$13
  Top 0.203: LINEOUT.3 9.02,36.96 C19.-
N$14
  Top 0.203: LINEOUT.2 5.93,35.56 7.13,34.37 8.11,34.37 8.16,34.42 C20.-
N$15
  Top 0.203: C21.- 7.75,31.88 LINEIN.3
N$16  (via drill 0.35)
  Top 0.203: v74.93,1.27 74.93,2.12 R23.2
  Bottom 0.203: 3V3_LED.1 75.68,1.27 v74.93,1.27
N$17
  Top 0.203: C23.- 6.31,30.52 LINEIN.2
N$18
  Top 0.203: U1.11 20.51,37.48 20.24,37.48 19.72,36.96 C19.+
N$19
  Top 0.203: TP2.T 59.75,74.87 U7.28
N$20
  Top 0.203: U1.12 20.51,36.98 20.25,36.98 17.68,34.42 C20.+
N$21
  Top 0.203: U1.13 20.51,36.48 20.25,36.48 18.31,34.54 18.31,33.59 16.6,31.88 C21.+
N$22
  Top 0.203: U1.14 20.51,35.98 20.25,35.98 18.67,34.4 C23.+
N$23
  Top 0.203: BT1.+ 10.54,58.28 R32.1 11.06,60.2 D18.A
N$24  (via drill 0.35)
  Top 0.203: R35.2 41.06,35.98 v41.91,36.83
  Bottom 0.203: v41.91,36.83 42.29,37.21 42.29,37.27 42.9,37.87 QWIIC_PU.3
N$25
  Top 0.203: R5.2 73.14,53.35 J_ASC.1
N$26  (via drill 0.35)
  Top 0.203: v41.91,35.56 40.1,35.56 39.72,35.18 37.63,35.18 R34.2
  Bottom 0.203: QWIIC_PU.1 42.95,35.56 v41.91,35.56
N$27
  Top 0.203: D10.A 77.08,2.57 R23.1
N$28
  Top 0.508: R14.2 13.14,70.44 C12.2 | R14.2 11.81,73.09 R4.1 | R15.1 13.14,72.19 R14.2
N$29  (via drill 0.35)
  Top 0.203: R24.2 v69.85,2.54
  Bottom 0.203: v69.85,2.54 VIN_LED2.1
N$30
  Top 1.016: D20.A 44.7,11 J8.2
N$31
  Top 0.203: R38.2 69.73,17.27 D17.C
N$32
  Top 0.203: R43.2 69.76,15.62 D21.C
N$33  (1 unrouted)
  Top 0.203: 2.5,37.21 1.35,36.05 1.35,31.26 2.89,29.71 19.27,29.71 19.52,29.47 C24.- 21.98,29.47 R2.2
N$34
  Top 0.203: D2.A 72.78,50.34 R5.1
N$35  (via drill 0.35)  (1 unrouted)
  Top 0.203: v24.91,39.98 24.51,39.58 24.36,39.58 24.11,39.33 U1.2 | v16.51,43.35 15.57,43.35 13.9,45.02 9.7,45.02
  Bottom 0.203: v16.51,43.35 23.97,43.35 25.07,42.25 25.07,41.77 24.91,41.61 v24.91,39.98
N$36
  Top 0.203: J9.VBUS1 8.25,8.5 7.95,8.5 7.44,8 7.44,4.7 7.95,4.2 8.25,4.2 J9.VBUS2
  Top 0.508: J9.VBUS2 9.87,3.9 F1.1
N$37
  Top 0.203: D16.A 73.27,2.57 R24.1
N$38
  Top 0.203: U1.10 18.84,38.08 C18.+
N$40
  Top 0.203: U1.15 20.51,35.48 20.25,35.48 20.11,35.33 20.11,33.17 C24.+
N$41
  Top 0.203: U1.30 25.21,37.68 25.46,37.68 25.88,38.1 C8.+ 27,38.2 U2.2
N$42
  Top 0.203: J_RSSI.1 69.33,53.35 R6.2
N$43
  Top 0.203: R6.1 70.73,50.43 D3.A
N$44
  Top 0.203: J_TX.1 61.71,53.35 R8.2
N$45
  Top 0.203: R8.1 63.11,50.43 D5.A
N$46
  Top 0.203: U1.5 22.61,39.99 22.18,40.42 C2.+
  Top 0.508: C1.+ 22.18,42.5 C2.+ 22.18,44.6 FB1.2
N$47  (via drill 0.3)
  other vias: 85.1,48
N$48  (via drill 0.35)  (1 unrouted)
  Top 0.203: 11.54,40.12 14.2,42.77 19.82,42.77 20.14,42.77 v21.6,41.3 | v23.19,40.17 23.11,40.09 U1.4
  Bottom 0.203: v23.19,40.17 22.05,41.3 v21.6,41.3
N$49
  Bottom 0.305: TH3.2 TH4.1
N$50
  Bottom 0.305: TH2.1 TH1.2
N$51  (via drill 0.3)
  other vias: 85.1,47.2
N$52  (via drill 0.3)
  other vias: 85.1,46.4
N$53  (via drill 0.3)
  other vias: 83.83,48.8
N$54  (via drill 0.3)
  Top 0.203: v90.63,26.63 90.63,26.61 U9.6
  Bottom 0.203: C32.1 90.54,26.63 v90.63,26.63 90.72,26.63 R11.2
N$55  (via drill 0.3)
  Top 0.203: v90.65,27.71 90.44,27.92 89.69,27.92 89.23,28.37 U9.2
  Bottom 0.203: R11.1 91.16,27.71 v90.65,27.71
N$56  (via drill 0.3)
  other vias: 83.83,48
N$57  (via drill 0.3)
  other vias: 83.83,47.2
N$58  (via drill 0.3)
  other vias: 83.83,46.4
N$59  (via drill 0.3)
  other vias: 85.1,29.75
N$60  (via drill 0.3)
  other vias: 85.1,28.95
N$61  (via drill 0.3)
  other vias: 85.1,28.15
N$62  (via drill 0.3)
  other vias: 85.1,27.35
N$63  (via drill 0.3)
  other vias: 83.83,29.75
N$64  (via drill 0.3)
  other vias: 83.83,28.95
N$65  (via drill 0.3)
  other vias: 83.83,28.15
N$66  (via drill 0.3)
  other vias: 83.83,27.35
N$67  (via drill 0.3)
  other vias: 85.1,9.43
N$68  (via drill 0.3)
  other vias: 85.1,8.63
N$69  (via drill 0.3)
  other vias: 85.1,7.83
N$70  (via drill 0.3)
  other vias: 85.1,7.03
N$71  (via drill 0.3)
  other vias: 83.83,9.43
N$72  (via drill 0.3)
  other vias: 83.83,8.63
N$73  (via drill 0.3)
  other vias: 83.83,7.83
N$74  (via drill 0.3)
  other vias: 83.83,7.03
N$75  (1 unrouted)
N$76  (1 unrouted)
N$78  (3 unrouted)
N$79  (1 unrouted)
N$80  (2 unrouted)
N$81  (3 unrouted)
N$82  (1 unrouted)
N$83  (1 unrouted)
N$84  (1 unrouted)
  Top 0.203: C31.+ 23.28,32.22 R2.1 | 21.7,33.8 21.1,33.8 20.51,34.39 20.51,35.08 U1.16
PA0/D0  (via drill 0.35)
  Top 0.203: U7.23 v66,70.41
  Bottom 0.203: E5_EXTRA_PINS.1 79.16,74.08 79.16,72.77 76.8,70.41 v66,70.41
PA2/TX2  (via drill 0.35)
  Top 0.203: E5_EXTRA_PINS.13 78.74,48.26 v78.74,63.5 | U7.19 70.36,67.29 71.52,66.13 v71.52,65.62
  Bottom 0.203: v71.52,65.62 76.62,65.62 v78.74,63.5
PA3/RX2  (via drill 0.35)
  Top 0.203: E5_EXTRA_PINS.14 78.06,46.4 78.06,62.91 v77.47,63.5 | U7.18 70.28,66.04 v71.5,64.81
  Bottom 0.203: v71.5,64.81 76.16,64.81 v77.47,63.5
PA9/D9  (via drill 0.35)
  Top 0.203: 70.34,69.79 U7.21 70.21,69.79 70.9,69.09 70.9,68.54 v72.26,67.18 | E5_EXTRA_PINS.11 79.88,52.2 79.88,64.77 79.88,64.9 v78.74,66.04
  Bottom 0.203: v72.26,67.18 77.6,67.18 v78.74,66.04
PA10/MOSI  (via drill 0.35)
  Top 0.203: U7.27 61,70.77 63.96,67.81 v67.1,67.81
  Bottom 0.203: E5_EXTRA_PINS.5 79.5,67.82 v67.11,67.82 v67.1,67.81
PA13/SWDIO
  Top 0.203: U7.3 56.04,67.29 53.13,70.21 48.54,70.21 E5_SWO.2
PA14/SWCLK
  Top 0.203: U7.4 56.95,66.59 56.24,66.59 52.98,69.85 E5_SWO.4
PB3/A3  (via drill 0.35)
  Top 0.203: E5_EXTRA_PINS.6 80.24,64.54 80.24,65.36 77.77,67.83 75.05,67.83 74.54,67.33 74.54,63.17 v73.6,62.23 | U7.8 60.3,60.59 60.3,61.3 60.45,61.44 61.19,61.44 v62,62.25
  Bottom 0.203: v62,62.25 73.58,62.25 v73.6,62.23
PB4/A4  (via drill 0.35)
  Top 0.203: U7.7 60.89,62.29 v60.96,62.36
  Bottom 0.203: v60.96,62.36 61.08,62.36 61.86,63.14 75.74,63.14 77.23,61.65 80.59,61.65 E5_EXTRA_PINS.7
PB5/LED  (via drill 0.35)
  Top 0.203: U7.11 v63.5,58.41
  Bottom 0.203: E5_EXTRA_PINS.10 68.57,53.34 v63.5,58.41
PB9/NSS  (via drill 0.35)
  Top 0.203: U7.25 63.5,70.77 65.06,69.21 v67.1,69.21
  Bottom 0.203: E5_EXTRA_PINS.3 79.38,69.22 v67.11,69.22 v67.1,69.21
PB10/D10  (via drill 0.35)
  Top 0.203: E5_EXTRA_PINS.12 79.41,50.13 79.41,64.1 v78.74,64.77 | v72.27,66.22 70.9,67.59 70.9,67.84 70.21,68.54 U7.20
  Bottom 0.203: v72.27,66.22 77.29,66.22 v78.74,64.77
PB13/BOOT/SCK  (via drill 0.35)  (1 unrouted)
  Top 0.203: U7.24 64.75,70.77 65.71,69.81 v67.85,69.81
  Bottom 0.203: E5_EXTRA_PINS.2 77.45,69.83 67.87,69.83 v67.85,69.81
PB14/MISO  (via drill 0.35)
  Top 0.203: U7.26 62.25,70.77 64.41,68.61 v67.85,68.61
  Bottom 0.203: E5_EXTRA_PINS.4 67.88,68.58 v67.85,68.61
PC0/RX1  (via drill 0.35)
  Top 0.203: U7.13 v66,58.41
  Bottom 0.203: E5_EXTRA_PINS.8 v66,58.41
PC1/TX1  (via drill 0.35)
  Top 0.203: U7.12 v64.75,58.41
  Bottom 0.203: E5_EXTRA_PINS.9 67.28,55.88 v64.75,58.41
QWIIC2_EN  (2 unrouted)
QWIIC_EN  (via drill 0.35)
  Top 0.203: J7.44 30.25,55.63 30.25,54.65 32.38,52.51 v32.38,50.8 | U3.3 47.02,45.27 R36.1 44.83,47.46 v44.83,48.13
  Bottom 0.203: v44.83,48.13 41.25,51.71 33.93,51.71 33.02,50.8 v32.38,50.8
RF  (via drill 0.35)
  Top 0.508: R14.1 14.71,71.72 C11.2
  Top 0.61: U7.15 69.16,62.63 68.16,62.63 67.89,62.9 67.89,62.92 v64.77,66.04 | R14.1 17.16,71.77 24.13,78.74 v49.53,78.74
  Bottom 0.61: v64.77,66.04 52.07,78.74 v49.53,78.74
RSSI  (via drill 0.35)
  Top 0.203: J3.6 56.1,65.05 56.1,61.73 58.42,59.41 v58.42,58.42 | J_RSSI.2 70.29,54.69 70.29,54.97 68.69,56.57 v58.42,56.57
  Bottom 0.203: v58.42,58.42 v58.42,56.57
RST  (via drill 0.35)
  Top 0.203: E5_EXTRA_PINS.15 77.46,44.46 77.46,59.33 77.47,59.34 v77.47,62.23 | U7.17 70.59,64.79 v71.5,63.88 | v53.35,66.04 E5_SWO.10
  Bottom 0.203: v77.47,62.23 75.82,63.88 v71.5,63.88 65.09,63.88 56.96,72.01 56.33,72.01 55.88,71.56 55.88,68.56 v53.35,66.04
RTC_3V  (via drill 0.35)
  Top 0.203: J7.72 23.25,57.82 23.33,57.9 23.33,58.38 22.99,58.72 22.4,58.72 v22.02,59.11 | R32.2 9.02,61.21 D18.C 10.41,63.12 D19.3 21.42,63.12 v21.93,62.61
  Bottom 0.203: v22.02,59.11 22.02,62.52 v21.93,62.61
RX  (via drill 0.35)  (2 unrouted)
  Top 0.203: J7.19 36.5,50.72 39.62,53.84 40.74,53.84 41.23,53.35 42.27,53.35 42.76,53.84 44.95,53.84 48.76,57.65 52.7,57.65 | 52.7,57.65 59.45,57.65 | v52.77,58.24 52.77,57.72 52.7,57.65 | D4.C 64.77,48.65 v64.77,49.53 | v62.87,61.67 61.92,61.67 | v53.94,73.66 54,73.72 J3.2 | 62.25,59.2 U7.10
  Bottom 0.203: v53.94,73.66 52.77,72.49 v52.77,58.24 | v64.77,49.53 62.87,51.44 v62.87,61.67
SCK_B  (via drill 0.3)
  Top 0.203: v87.63,43.6 87.63,39.16 87.5,39.03 87.5,25.9 89.03,24.37 89.03,21.9 v88.43,21.3
  Bottom 0.203: MK1.6 90.12,11.04 90.12,10.83 90.27,10.68 90.88,10.68 91.13,10.93 91.13,14.96 90.66,15.43 90.51,15.43 89.28,16.66 89.28,19.94 88.27,20.95 | MK2.4 87.65,43.62 v87.63,43.6 | J15.3 88.27,20.95 | 88.27,20.95 88.28,20.95 v88.43,21.3
SCL_B  (via drill 0.3)
  Top 0.203: U9.4 90.84,28.42 v90.84,30.48 90.84,36.81 U10.1
  Bottom 0.203: J10.4 v90.84,30.48
SD_!CS!  (via drill 0.35)
  Top 0.203: J7.55 v27.5,48.08 29.02,46.56 v29.02,45.91
  Bottom 0.203: 24.13,49.63 26.26,47.5 26.92,47.5 v27.5,48.08 | v29.02,45.91 28,44.9 28,30.04
SD_B
  Bottom 0.203: MK2.6 86.48,45.37 86.46,45.37 86.24,45.15 86.24,20.55 86.39,20.4 86.83,20.4 J15.4 87.75,19.95 88.93,18.77 88.93,13.97 | MK1.7 90.38,11.43 90.38,11.64 88.93,13.09 88.93,13.97 | R18.2 89.69,14.73 88.93,13.97
SD_CLK  (via drill 0.35)  (1 unrouted)
  Top 0.203: J7.60 26.25,56.01 v26.63,55.63 | v28.57,52.96 28.48,52.86 21.18,52.86 20.07,53.98 20.07,54.99 v18.67,56.39 | v14.91,22.64 16.59,22.64 J2.5
  Bottom 0.203: 29.4,54.36 28.13,55.63 v26.63,55.63 | 29.34,52.96 v28.57,52.96 | v18.67,56.39 15.75,56.39 14.91,55.55 14.91,27.56 15.27,27.2 15.27,22.99 v14.91,22.64
SD_CMD  (via drill 0.35)  (1 unrouted)
  Top 0.203: J7.62 v25.75,58.14 | v31.24,52.83 31,52.59 29.02,52.59 28.82,52.38 21.16,52.38 19.68,53.85 19.68,54.1 v18.03,55.75 | v15.29,20.31 16.72,20.31 J2.3
  Bottom 0.203: 32.51,55.19 30.82,56.88 27,56.88 v25.75,58.14 | 32.5,53.33 31.74,53.33 v31.24,52.83 | v18.03,55.75 15.88,55.75 15.39,55.27 15.39,27.58 15.62,27.35 15.62,20.64 v15.29,20.31
SD_DATA0  (via drill 0.35)  (1 unrouted)
  Top 0.203: J7.64 25.25,55.76 v25.89,55.12 | v25.53,53.47 25.4,53.34 21.26,53.34 20.49,54.11 20.49,55.83 v19.3,57.02 | v14.66,24.71 14.7,24.67 J2.7
  Bottom 0.203: 26.61,54.36 25.89,55.08 v25.89,55.12 | 26.8,53.47 v25.53,53.47 | v19.3,57.02 15.75,57.02 14.43,55.7 14.43,46.55 12.2,44.31 12.2,43.32 12.52,43 12.9,42.61 14.43,41.09 14.43,40.64 14.43,27.54 14.91,27.05 14.91,25.4 14.66,25.15 v14.66,24.71
SD_DATA1  (via drill 0.35)
  Top 0.203: J7.66 24.75,58.27 22.75,60.27 17.03,60.27 v16.35,59.59 v16.34,59.59 | v14.1,25.81 16.72,25.81 J2.8
  Bottom 0.203: v16.34,59.59 13.39,56.64 13.39,46.99 13.39,46.91 13.39,46.51 11.48,44.61 11.48,43.02 13.39,41.12 13.39,26.53 v14.1,25.81
SD_DATA2  (via drill 0.35)
  Top 0.203: J7.68 24.25,58.07 22.63,59.69 17.53,59.69 v17.4,59.56 | J2.1 16.26,18.57 15.16,18.57 13.52,20.2 13.52,26.05 13.97,26.5 v13.97,26.92
  Bottom 0.203: v17.4,59.56 13.97,56.13 13.97,46.59 11.84,44.46 11.84,43.17 13.97,41.04 v13.97,26.92
SD_DATA3  (via drill 0.35)  (1 unrouted)
  Top 0.203: J7.70 23.8,56.83 v23.8,55.49 | v19.18,53.47 17.47,55.17 v17.4,55.17 | v15.37,19.18 J2.2
  Bottom 0.203: 24.13,55.16 v23.8,55.49 | 19.3,53.34 v19.18,53.47 | v17.4,55.17 16.06,55.17 15.88,54.99 15.88,27.6 15.98,27.49 15.98,19.79 v15.37,19.18
SD_DETECT  (1 unrouted)
SD_EN  (via drill 0.35)
  Top 0.203: U4.3 35.27,33.02 R21.1 35.14,34.71 34.29,35.56 32.73,35.56 v32.67,35.5 | v32.65,45.72 32.65,46.43 33.4,47.19 33.4,53.45 30.85,56.01 30.85,56.79 J7.42
  Bottom 0.203: v32.67,35.5 32.67,45.7 v32.65,45.72
SDA_B  (via drill 0.3)
  Top 0.203: U9.3 89.97,28.39 v89.97,31.75 89.97,36.02 U10.6
  Bottom 0.203: J10.3 89.7,31.48 v89.97,31.75
SEL_MK1  (via drill 0.3)  (1 unrouted)
  Top 0.203: v90.17,10.12 90.17,11.64 89.28,12.53 89.28,13.38 89.79,13.88 89.79,13.97
  Bottom 0.203: MK1.1 90.38,9.28 90.38,9.49 90.17,9.7 v90.17,10.12
SEL_MK2  (via drill 0.3)  (1 unrouted)
  Top 0.203: 89.79,41.91 90.23,42.35 90.91,42.35 91.06,42.5 91.06,44.83 v88.9,46.99
  Bottom 0.203: MK2.2 88.02,46.99 v88.9,46.99
SPI_CIPO  (via drill 0.35)
  Top 0.203: J7.61 v26,50.59
  Bottom 0.203: 31.56,52.32 29.24,50.01 26.58,50.01 v26,50.59
SPI_COPI  (via drill 0.35)
  Top 0.203: J7.59 v26.5,48.08
  Bottom 0.203: 26.61,52.32 25.42,51.14 25.42,49.16 v26.5,48.08
SPI_SCK  (via drill 0.35)
  Top 0.203: J7.57 v27,50.59
  Bottom 0.203: 28.73,52.32 v27,50.59
SWDCK
  Top 0.203: J7.21 36,51.24 39.37,54.61 40.47,54.61 41.38,53.7 42.12,53.7 43.03,54.61 44.71,54.61 46.22,56.12 46.22,57.28 45.59,57.91 45.59,58.93 MM_SWO.4
SWDIO  (via drill 0.35)
  Top 0.203: J7.23 35.5,51.45 39.1,55.05 40.91,55.05 41.38,55.52 42.12,55.52 42.53,55.11 44.5,55.11 45.72,56.33 45.72,57.15 45.62,57.25 v45.44,57.25
  Bottom 0.203: v45.44,57.25 45.44,57.5 MM_SWO.2
TS  (via drill 0.35)
  Top 0.203: U5.10 76.14,42.11 v76.58,41.67 | v57.62,33.49 v55.82,31.69
  Top 0.305: THERM2.2 60.68,10.44 v59.69,11.43 59.69,12.59 U6.1
  Bottom 0.203: v76.58,41.67 70.43,35.52 70.43,35.32 68.61,33.49 v57.62,33.49 | TH3.1 53.91,29.78 v55.82,31.69
  Bottom 0.305: v59.69,11.43 58.42,12.7 58.42,20.59 TH3.1 TH1.1
TX  (via drill 0.35)  (2 unrouted)
  Top 0.203: J7.17 37,50.52 39.82,53.34 40.73,53.34 41.08,52.99 42.42,52.99 42.77,53.34 45.16,53.34 48.97,57.15 51.82,57.15 | 51.82,57.15 60.2,57.15 | v51.97,71.32 51.97,72.18 J3.3 | v51.97,56.54 51.97,57 51.82,57.15 | 62.25,58.44 v62.23,58.42 | v62.23,49.53 61.35,48.65 D5.C | 61,59.2 U7.9
  Bottom 0.203: v51.97,71.32 v51.97,56.54 | v62.23,58.42 v62.23,49.53
USB_D+  (via drill 0.35)
  Top 0.203: v25.32,22.23 25.29,22.23 23.14,20.07 21.66,20.07 21.51,19.93 21.51,18.14 v21.28,17.92 | v31.88,39.5 33.66,41.27 v34.92,41.27 | v40.64,45.72 40.64,48.41 40.6,48.45 40.6,49.24 J7.3 | J9.B6 8.65,5.7 9.15,5.7 9.3,5.84 9.3,6.36 9.11,6.55 8.6,6.55 J9.A6 9.96,6.6 v10.18,6.81
  Bottom 0.203: v25.32,22.23 28.87,25.78 28.87,36.49 v31.88,39.5 | v34.92,41.27 34.99,41.27 38.17,44.45 39.37,44.45 v40.64,45.72 | v10.18,6.81 v21.28,17.92
USB_D-  (via drill 0.35)
  Top 0.203: v24,21.84 24,21.65 22.79,20.43 21.51,20.43 21.15,20.07 21.15,18.61 v20.32,17.78 | v31.94,40.7 33.39,42.15 v34.99,42.15 | J9.A7 8.45,6.2 7.95,6.2 7.8,6.34 7.8,6.86 7.95,7 8.45,7 J9.B7 9.64,7.1 v10.16,7.62 | J7.5 40,46.2 v38.88,45.08
  Bottom 0.203: v24,21.84 28.45,26.29 28.45,37.21 v31.94,40.7 | v10.16,7.62 v20.32,17.78 | v38.88,45.08 38.6,44.81 38.02,44.81 35.37,42.15 v34.99,42.15
USB_VIN  (via drill 0.35)
  Top 0.203: J7.9 39,48.06 38.23,47.29 v38.23,43.69
  Top 0.508: F1.2 15.97,4.33 D15.A 16.51,4.58 13.75,7.34 13.75,9.45 14.46,10.16 31.75,10.16 32.11,10.52 32.11,17.02 35.56,20.47 v35.56,30.53
  Bottom 0.508: v35.56,30.53 38.23,33.19 v38.23,43.69
V+  (via drill 0.35)  (7 unrouted)
  Top 0.203: v72.39,5.08 72.39,8.27 75.5,11.38 75.55,11.43 | U6.11 60.96,16.11 U6.10 | U6.5 62.57,13.96 62.97,13.96 62.97,13.97 v63.5,13.97 | v62.23,17.85 62.23,19.05 | C27.+ 39.5,30.35 | U8.6 48.9,31.11
  Top 0.508: 39.5,30.35 41.91,27.94 | U4.1 37.78,29.53 41.91,25.4 | 41.91,27.94 43.18,29.21 v43.18,30.48 44.45,31.75 48.26,31.75 48.9,31.11 | U3.1 47.02,41.56 v46.99,41.53 | 60.96,16.11 60.96,19.05 | 41.91,27.94 41.91,32 C26.1 C25.1 45.08,34.16
  Top 1.016: POWER_PINS.4 75.55,11.43 | 72.6,16.47 70.02,19.05 62.23,19.05 60.96,19.05 48.26,19.05 41.91,25.4 41.91,27.94
  Bottom 0.203: VIN_LED2.2 71.64,4.33 v72.39,5.08 | v63.5,13.97 62.23,15.24 v62.23,17.85
  Bottom 0.508: v46.99,41.53 46.99,34.29 v43.18,30.48
V_BATT  (via drill 0.35)
  Top 0.203: R17.1 75.95,39.12 75.64,39.43 U5.7 | U6.2 60.96,13.11 U6.3
  Top 0.508: 60.96,13.11 61.16,12.9 61.16,12.54 62.2,11.5 64.01,11.5 v64.01,11.43 | v76.2,10.16 80.01,10.16 POWER_PINS.3
  Top 1.016: v76.2,37.59 75.95,37.84 75.95,39.12
  Bottom 0.508: v64.01,11.43 65.28,10.16 v76.2,10.16
  Bottom 1.016: POWER_PINS.3 79.68,10.49 79.68,26.96 80.27,27.55 80.27,32.68 78.74,34.22 78.74,35.56 76.71,37.59 v76.2,37.59
V_BATT_IN  (2 unrouted)
V_USB_IN  (2 unrouted)
VBUS  (via drill 0.35)  (3 unrouted)
  Top 0.203: U6.13 57.03,15.36 v57.01,15.38 | v48.26,16.51 47.38,16.51 D20.C
  Top 1.016: D20.C 46.24,18.15 44.2,20.19 JP5.1 34.29,16.64 34.29,8.57 C5.1 C4.1 16.68,8.57 | v49.53,20.32 49.63,20.22 70.8,20.22 77.04,13.97 POWER_PINS.5
  Bottom 0.203: v57.01,15.38 49.39,15.38 v48.26,16.51
  Bottom 1.016: v49.53,20.32 37.97,20.32 JP5.1
VIN  (via drill 0.35)  (4 unrouted)
  Top 0.203: U5.8 75.68,41.27 76.16,41.27 76.38,41.05 v76.38,40.46 | U5.6 71.69,39.95 C3.1 73.66,37.97 R10.2
  Top 0.406: R10.2 75.84,36.42 R17.2
  Top 1.016: R17.2 v76.2,34.29 | 67.38,7.62 C22.1 C15.1 67.82,7.62 v68.58,7.62
  Bottom 0.203: v76.2,34.29 76.2,36.51 75.44,37.28 75.44,39.51 v76.38,40.46
  Bottom 1.016: v76.2,34.29 77.41,33.08 77.88,33.08 79.11,31.85 | 79.11,28.03 78.51,27.44 78.51,9.93 76.2,7.62 v68.58,7.62
VIN/3  (via drill 0.35)
  Top 0.203: J7.49 29,50.19 29.46,50.65 v30.71,50.65 | v45.66,48.2 50.29,43.57 53.27,43.57 v53.34,43.49 | R10.1 R9.2 70.86,35.56 v69.85,35.56
  Bottom 0.203: v30.71,50.65 31.75,51.69 33.4,51.69 33.78,52.07 41.91,52.07 45.66,48.32 v45.66,48.2 | v69.85,35.56 61.27,35.56 v53.34,43.49
WS_B
  Bottom 0.203: MK1.5 89.28,11.34 88.53,12.08 88.53,18.17 87.75,18.95 J15.5 86.83,19.4 86.39,19.4 85.88,19.91 85.88,45.7 86.46,46.27 86.48,46.27 MK2.1
XB_ON
  Top 0.203: XB_EXTRA_PINS.1 78.18,37.39 78.18,43.02 76,45.2 76,57.52 74.9,58.62 74.9,59.68 76,60.78 J3.13
XB_RST  (via drill 0.35)
  Top 0.203: J3.5 51,68.25 v51.18,68.07 | v52.01,49.59 53.34,48.26 v53.34,46.99
  Bottom 0.203: v51.18,68.07 51.18,50.42 v52.01,49.59 | v53.34,46.99 73.24,46.99 81.28,38.95 XB_EXTRA_PINS.2

## Text on the board
tPlace: GOOD | CHG | GND | BAIT | by | SmallThings | Opt. Cap | CE | THM | 10V Max | V2.0.1 (23F14)
bPlace: D- | D+ | EN1 | Low | High | EN2
Document: 50 ohm impedance / control on the RF / line from its origin / on the WIO-E5 chip / through to ANT1 / and ANT2